# EAGLE design S111X (EAGLE 6.6.0)
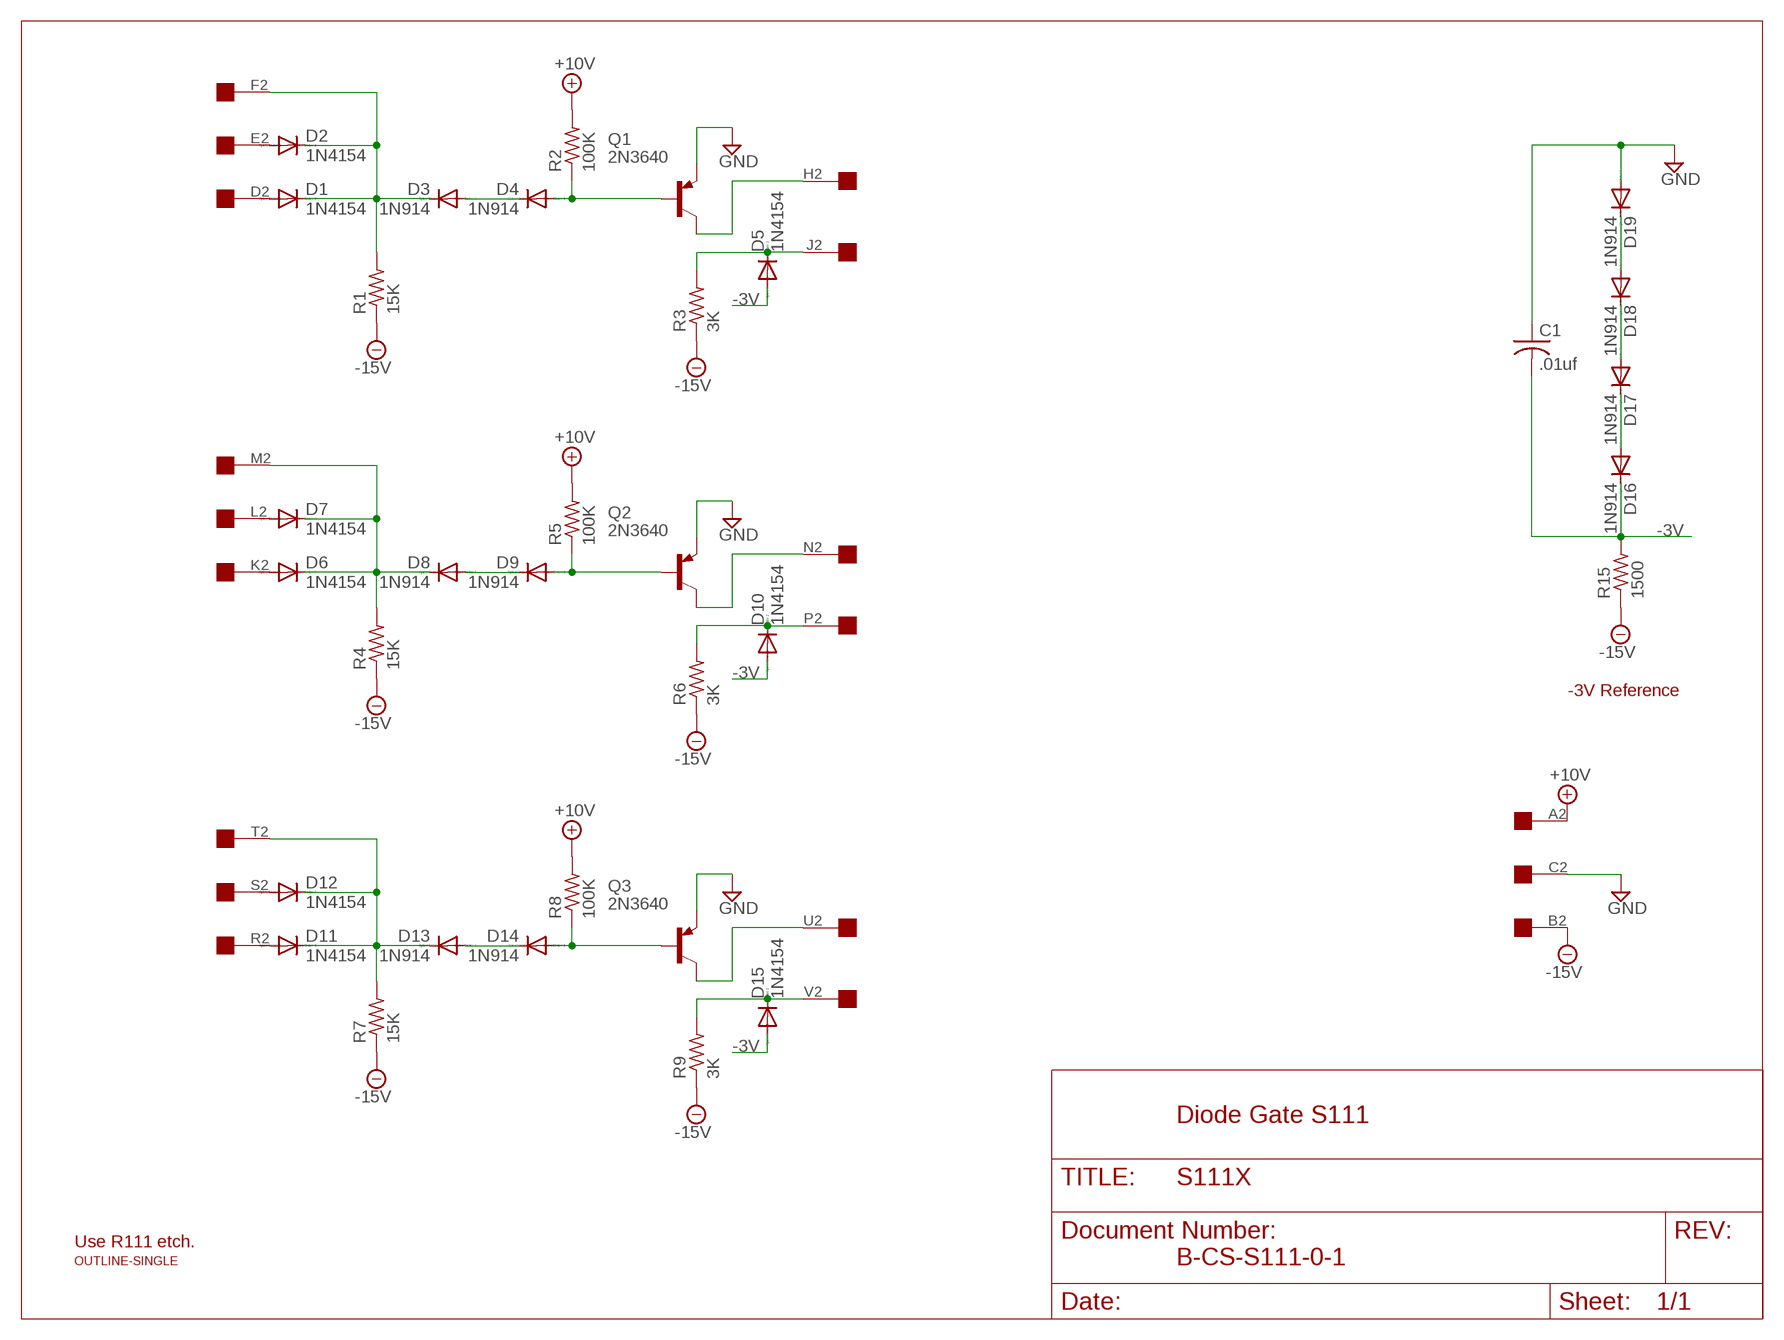
[diagram p0: schematic, sheet 1]

## Parts
C1  .01uf  C-US050-025X075  [C050-025X075]
D1  1N4154  1N4148DO35-10  [DO35-10]
D2  1N4154  1N4148DO35-10  [DO35-10]
D3  1N914  1N4148DO35-10  [DO35-10]
D4  1N914  1N4148DO35-10  [DO35-10]
D5  1N4154  1N4148DO35-10  [DO35-10]
D6  1N4154  1N4148DO35-10  [DO35-10]
D7  1N4154  1N4148DO35-10  [DO35-10]
D8  1N914  1N4148DO35-10  [DO35-10]
D9  1N914  1N4148DO35-10  [DO35-10]
D10  1N4154  1N4148DO35-10  [DO35-10]
D11  1N4154  1N4148DO35-10  [DO35-10]
D12  1N4154  1N4148DO35-10  [DO35-10]
D13  1N914  1N4148DO35-10  [DO35-10]
D14  1N914  1N4148DO35-10  [DO35-10]
D15  1N4154  1N4148DO35-10  [DO35-10]
D16  1N914  1N4148DO35-10  [DO35-10]
D17  1N914  1N4148DO35-10  [DO35-10]
D18  1N914  1N4148DO35-10  [DO35-10]
D19  1N914  1N4148DO35-10  [DO35-10]
Q1  2N3640  2N3637  [TO39]
Q2  2N3640  2N3637  [TO39]
Q3  2N3640  2N3637  [TO39]
R1  15K  R-US_0207/10  [0207/10]
R2  100K  R-US_0207/10  [0207/10]
R3  3K  R-US_0207/10  [0207/10]
R4  15K  R-US_0207/10  [0207/10]
R5  100K  R-US_0207/10  [0207/10]
R6  3K  R-US_0207/10  [0207/10]
R7  15K  R-US_0207/10  [0207/10]
R8  100K  R-US_0207/10  [0207/10]
R9  3K  R-US_0207/10  [0207/10]
R15  1500  R-US_0207/10  [0207/10]
U$1  OUTLINE-SINGLE  [SINGLE]
U$2  EDGE-1  [EDGE-CON1]

## Nets
+10V [Power]: R2.2 R5.2 R8.2 U$2.A2
-3V [Power]: C1.2 D5.A D10.A D15.A D16.C R15.2
-15V [Power]: R1.1 R3.1 R4.1 R6.1 R7.1 R9.1 R15.1 U$2.B2
GND [Power]: C1.1 D19.A Q1.1(E) Q2.1(E) Q3.1(E) U$2.C2
N$1: D6.A U$2.K2
N$2: D9.A Q2.2(B) R5.1
N$3: D18.A D19.C
N$4: D10.C R6.2 U$2.P2
N$5: Q1.3(C) U$2.H2
N$6: D6.C D7.C D8.C R4.2 U$2.M2
N$7: D8.A D9.C
N$8: D14.A Q3.2(B) R8.1
N$9: D15.C R9.2 U$2.V2
N$10: D11.A U$2.R2
N$11: D11.C D12.C D13.C R7.2 U$2.T2
N$12: D13.A D14.C
N$13: D17.A D18.C
N$14: D7.A U$2.L2
N$15: Q2.3(C) U$2.N2
N$16: D16.A D17.C
N$17: Q3.3(C) U$2.U2
N$19: D4.A Q1.2(B) R2.1
N$20: D5.C R3.2 U$2.J2
N$21: D1.A U$2.D2
N$22: D1.C D2.C D3.C R1.2 U$2.F2
N$23: D3.A D4.C
N$31: D12.A U$2.S2
N$39: D2.A U$2.E2

## Notes on the sheet
- -3V Reference
- Diode Gate S111
- Use R111 etch.
- B-CS-S111-0-1

## Library data of the parts
C1 = rcl:C-US: CAPACITOR, American symbol
D1-D19 = diode:1N4148: DIODE high speed (Philips)
Q1-Q3 = transistor-pnp:2N3637*: PNP Transistror
R1-R9 R15 = rcl:R-US_: RESISTOR, American symbol
U$1 = dec-con:OUTLINE-*: Board outlines for DEC boards.
U$2 = dec-con:EDGE-1: Single-Sided DEC Edge Connector -- (side 2)

## Net classes
1 Power: width 0.813 mm

## Board
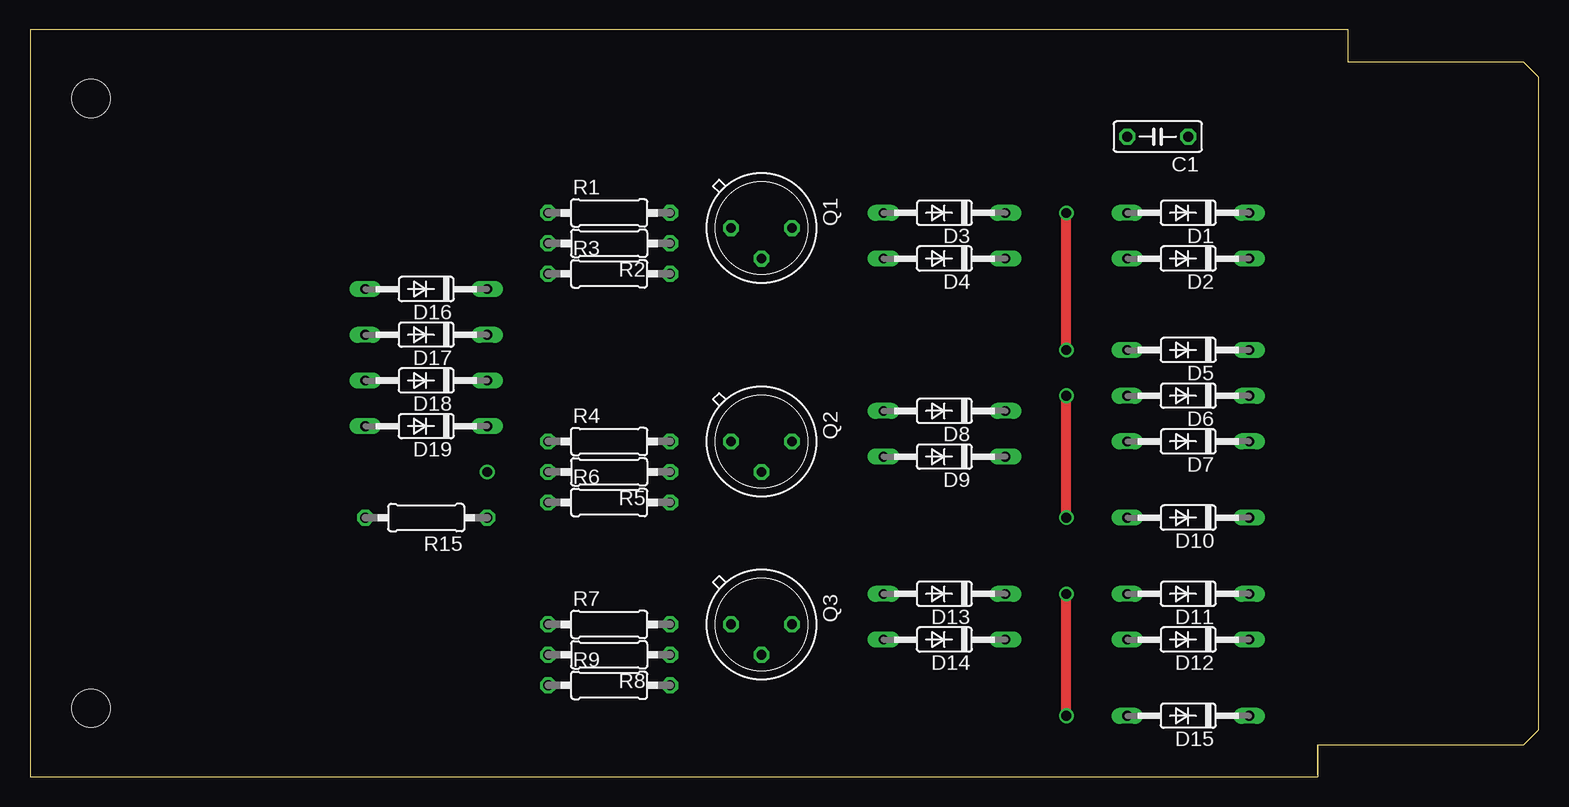
[diagram p1: board, top side]
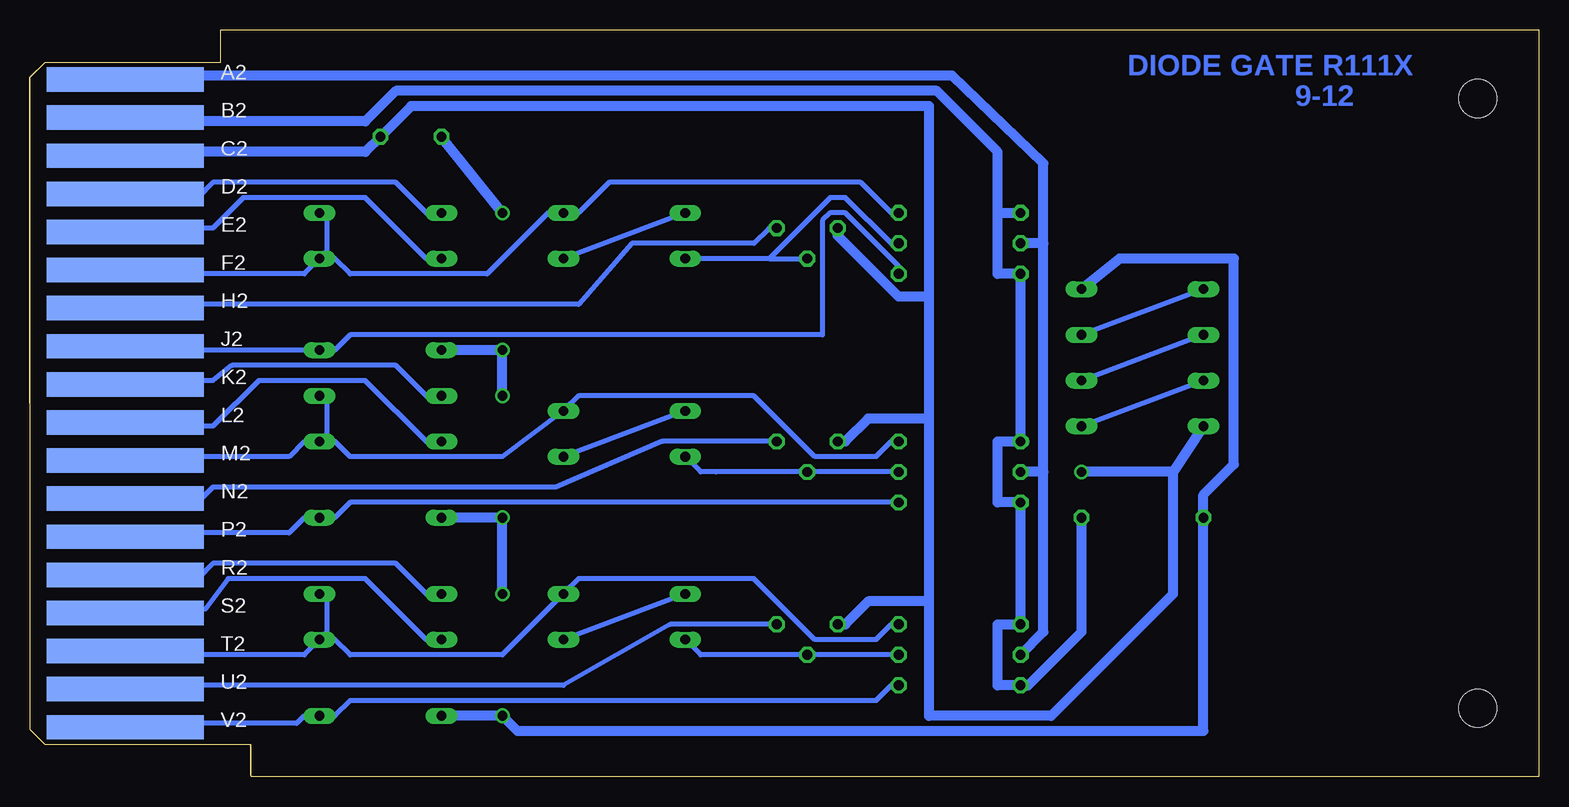
[diagram p2: board, bottom side, seen from below]

Size 125.73 x 62.23 mm. Coordinates in mm from the lower left corner, seen from the top.
Copper layers (1+16): Top 0.035mm / dielectric 1.5mm / Bottom 0.035mm
Design rules "16mils": minimum track width 16mil, minimum drill 32mil, track to track 15mil, track to pad 10mil, pad to pad 10mil, via to via 10mil, smd to smd 10mil, copper to edge 13mil, drill to drill 10mil, minimum pad ring 10mil, minimum via ring 8mil, stop-mask expansion 0mil, vias tented up to drill 0mil, thermal gap 10mil

### Footprints (pad centres in the part's own frame; a part is rotated, then mirrored left to right if it is on the bottom)
C050-025X075 = drill 0.813 octagon: 1 -2.54,0; 2 2.54,0
DO35-10 = drill 0.813 long: A 5.08,0; C -5.08,0
TO39 = drill 0.813 octagon: 1 0,-2.54; 2 2.54,0; 3 0,2.54
0207/10 = drill 0.813 octagon: 1 -5.08,0; 2 5.08,0
SINGLE = hole 3.175: 120.65,56.515; 120.65,5.715
EDGE-CON1 = smd 13.106 x 2.032 bottom: A2 7.938,4.128; B2 7.938,7.303; C2 7.938,10.477; D2 7.938,13.652; E2 7.938,16.828; F2 7.938,20.003; H2 7.938,23.177; J2 7.938,26.352; K2 7.938,29.527; L2 7.938,32.703; M2 7.938,35.877; N2 7.938,39.053; P2 7.938,42.227; R2 7.938,45.403; S2 7.938,48.578; T2 7.938,51.752; U2 7.938,54.928; V2 7.938,58.102

### Placement (x,y rotation side)
C1  93.98,53.34 180 top
D1  96.52,46.99 180 top
D2  96.52,43.18 180 top
D3  76.2,46.99 180 top
D4  76.2,43.18 180 top
D5  96.52,35.56 180 top
D6  96.52,31.75 180 top
D7  96.52,27.94 180 top
D8  76.2,30.48 180 top
D9  76.2,26.67 180 top
D10  96.52,21.59 180 top
D11  96.52,15.24 180 top
D12  96.52,11.43 180 top
D13  76.2,15.24 180 top
D14  76.2,11.43 180 top
D15  96.52,5.08 180 top
D16  33.02,40.64 180 top
D17  33.02,36.83 180 top
D18  33.02,33.02 180 top
D19  33.02,29.21 180 top
Q1  60.96,45.72 270 top
Q2  60.96,27.94 270 top
Q3  60.96,12.7 270 top
R1  48.26,46.99 0 top
R2  48.26,44.45 180 top
R3  48.26,41.91 0 top
R4  48.26,27.94 0 top
R5  48.26,25.4 180 top
R6  48.26,22.86 0 top
R7  48.26,12.7 0 top
R8  48.26,10.16 180 top
R9  48.26,7.62 0 top
R15  33.02,21.59 180 top
U$1  125.73,62.23 180 top
U$2  125.73,62.23 180 top

### Tracks (layer width: path | path; a pad name or v marks a point on that pad's centre or on a via)
+10V
  Bottom 0.813: R8.2 41.27,12.06 41.27,25.4 | 41.27,25.4 R5.2 | 41.27,25.4 41.27,44.45 | 41.27,44.45 41.27,51.12 48.9,58.42 111.76,58.42 U$2.A2 | 41.27,44.45 R2.2
-3V  (via drill 0.81)
  Top 0.813: v86.36,5.08 v86.36,15.24 | v86.36,21.59 v86.36,31.75 | v86.36,35.56 v86.36,46.99
  Bottom 0.813: v86.36,31.75 v86.36,35.56 D5.A | v86.36,15.24 v86.36,21.59 D10.A | v86.36,46.99 C1.2 | D16.C 34.92,43.18 25.4,43.18 25.4,26.04 27.94,23.5 R15.2 27.94,3.81 85.09,3.81 v86.36,5.08 D15.A
-15V
  Bottom 0.813: R4.1 R3.1 45.09,41.91 45.09,46.99 | 45.09,46.99 R1.1 | R15.1 38.1,12.06 42.55,7.62 R9.1 45.09,7.62 45.09,12.7 R7.1 R6.1 45.09,22.86 45.09,27.94 R4.1 | R4.1 42.86,27.94 | 45.09,46.99 45.09,52.07 50.16,57.15 95.25,57.15 97.79,54.61 113.67,54.61 U$2.B2
GND  (via drill 0.81)
  Bottom 0.813: 50.8,14.61 50.8,5.08 40.64,5.08 30.48,15.24 30.48,25.4 | 50.8,14.61 50.8,29.84 | 50.8,29.84 50.8,40.01 | 50.8,40.01 50.8,55.88 93.98,55.88 C1.1 97.79,52.07 113.03,52.07 U$2.C2 | 30.48,25.4 D19.A | 30.48,25.4 v38.1,25.4 | 50.8,14.61 55.88,14.61 57.78,12.7 Q3.1 | 50.8,29.84 55.88,29.84 57.78,27.94 Q2.1 | 50.8,40.01 53.34,40.01 58.42,45.09 Q1.1
N$1
  Bottom 0.406: D6.A 92.71,31.75 95.25,34.29 108.9,34.29 110.49,33.02 111.76,33.02 U$2.K2
N$2
  Bottom 0.406: R5.1 Q2.2 68.58,25.4 69.85,25.4 D9.A
N$3
  Bottom 0.406: D18.A D19.C
N$4
  Bottom 0.406: U$2.P2 112.39,20.32 104.14,20.32 102.87,21.59 D10.C 100.33,21.59 99.06,22.86 R6.2
N$5
  Bottom 0.406: Q1.3 64.14,45.72 65.41,44.45 75.56,44.45 80.01,39.37 111.76,39.37 U$2.H2
N$6
  Bottom 0.406: D7.C 100.97,28.57 100.97,31.11 D6.C | D7.C 102.87,27.94 104.14,26.67 112.39,26.67 U$2.M2 | R4.2 53.98,27.94 55.24,26.67 60.33,26.67 65.41,31.75 80.01,31.75 D8.C 86.36,26.67 99.06,26.67 100.33,27.94 D7.C
N$7
  Bottom 0.406: D8.A D9.C
N$8
  Bottom 0.406: R8.1 Q3.2 69.85,10.16 D14.A
N$9
  Bottom 0.406: U$2.V2 111.76,4.45 103.5,4.45 102.87,5.08 D15.C 100.33,5.08 99.06,6.35 55.24,6.35 53.98,7.62 R9.2
N$10
  Bottom 0.406: D11.A 92.71,15.24 95.25,17.78 110.49,17.78 111.76,16.51 U$2.R2
N$11
  Bottom 0.406: R7.2 53.98,12.7 55.24,11.43 60.33,11.43 65.41,16.51 80.01,16.51 D13.C 86.36,10.16 99.06,10.16 100.33,11.43 D12.C | D12.C 100.97,12.06 100.97,14.61 D11.C | D12.C 102.87,10.16 112.08,10.16 U$2.T2
N$12
  Bottom 0.406: D13.A D14.C
N$13
  Bottom 0.406: D17.A D18.C
N$14
  Bottom 0.406: D7.A 92.71,27.94 97.79,33.02 106.68,33.02 110.49,29.21 113.03,29.21 U$2.L2
N$15
  Bottom 0.406: Q2.3 73.03,27.94 81.92,24.13 110.49,24.13 111.76,22.86 U$2.N2
N$16
  Bottom 0.406: D16.A D17.C
N$17
  Bottom 0.406: Q3.3 72.39,12.7 81.28,7.62 111.76,7.62 U$2.U2
N$19
  Bottom 0.406: 64.14,43.18 Q1.2 | 64.14,43.18 D4.A | 64.14,43.18 59.05,48.26 57.78,48.26 53.98,44.45 R2.1
N$20
  Bottom 0.406: U$2.J2 111.76,35.56 D5.C 100.33,35.56 99.06,36.83 59.69,36.83 59.69,46.35 59.05,46.99 57.78,46.99 53.34,42.55 R3.2
N$21
  Bottom 0.406: D1.A 92.71,46.99 95.25,49.53 110.49,49.53 111.76,48.26 U$2.D2
N$22
  Bottom 0.406: D1.C 100.97,46.35 100.97,43.81 D2.C | U$2.F2 111.76,41.91 102.87,41.91 D2.C | R1.2 53.98,46.99 56.52,49.53 77.47,49.53 80.01,46.99 D3.C 82.55,46.99 87.63,41.91 99.06,41.91 100.33,43.18 D2.C
N$23
  Bottom 0.406: D3.A D4.C
N$31
  Bottom 0.406: D12.A 92.71,11.43 97.79,16.51 109.22,16.51 111.12,13.97 111.76,13.97 U$2.S2
N$39
  Bottom 0.406: D2.A 92.71,43.18 97.79,48.26 107.95,48.26 110.49,45.72 111.76,45.72 U$2.E2

### Text on the board
Bottom: DIODE GATE R111X | 9-12